# Altium project 12F675_PCB.PrjPcb
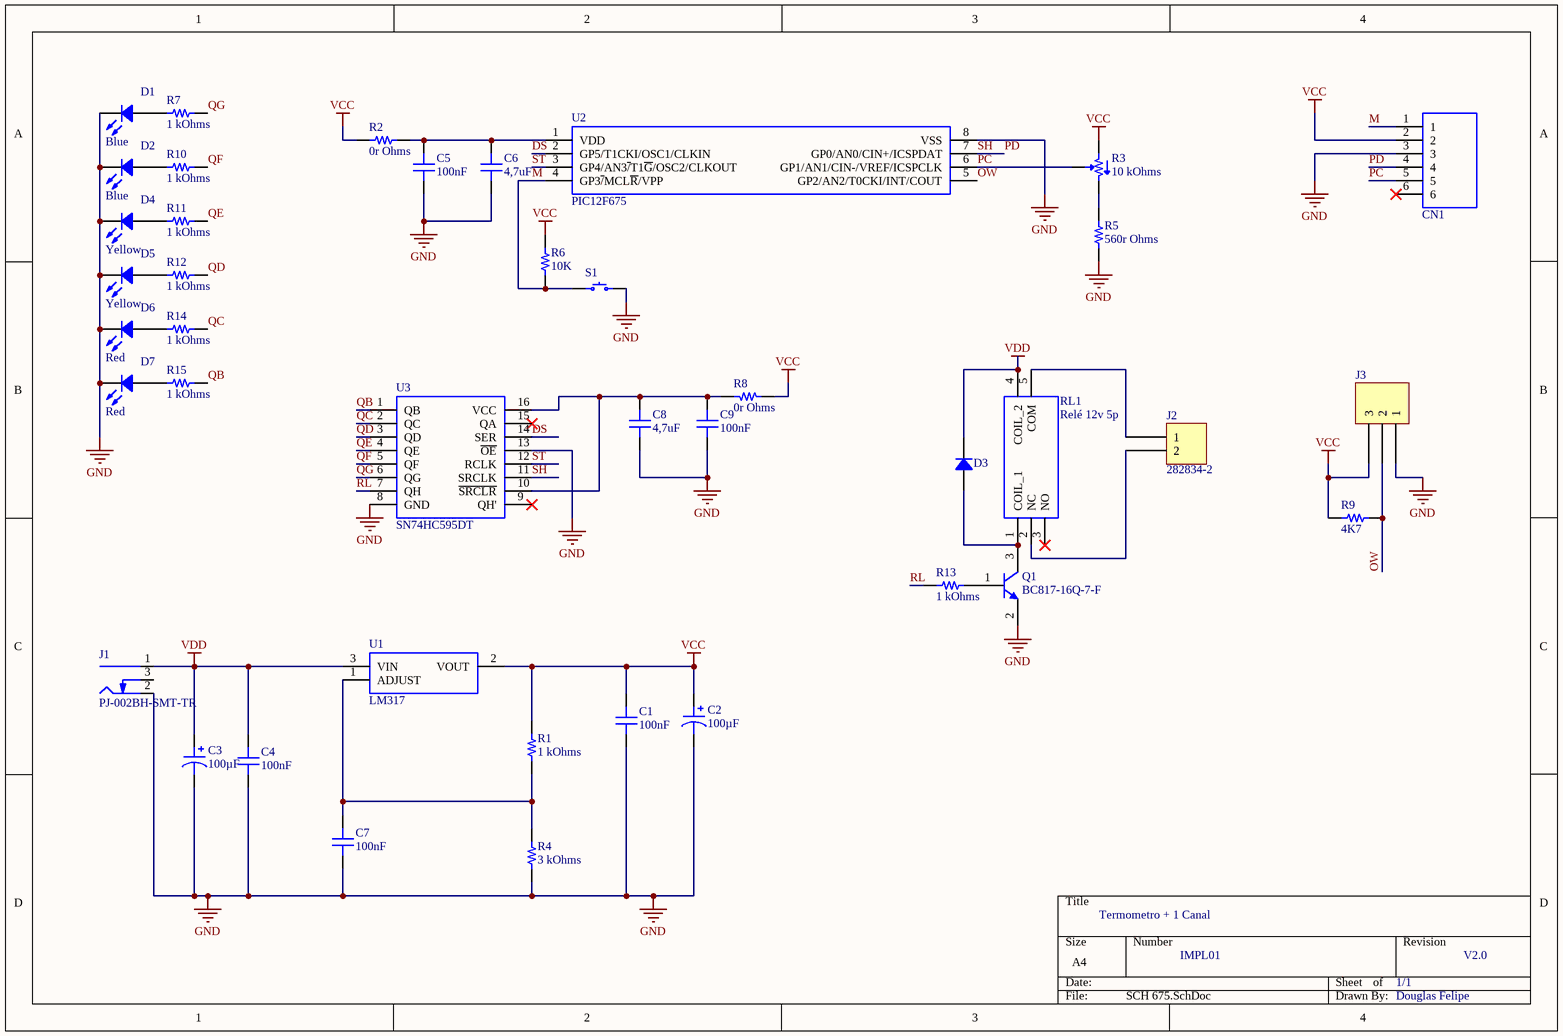
[diagram p0: SCH 675.SchDoc]
1 sheet, 41 parts. Net scope: global (net labels, ports and power ports of the same name join across sheets).
Board file: PCB675.PcbDoc

## Sheet SCH 675.SchDoc
size A4; SheetNumber: 1; SheetTotal: 1

### Parts
C1  100nF  [CAP 0805_2012]
C2  100µF  [CAP ALSMD 8.3MM H10.5MM]
C3  100µF  [CAP ALSMD 8.3MM H10.5MM]
C4  100nF  [CAP 0805_2012]
C5  100nF  [CAP 0805_2012]
C6  4,7uF  [CAP 0805_2012]
C7  100nF  [CAP 0805_2012]
C8  4,7uF  [CAP 0805_2012]
C9  100nF  [CAP 0805_2012]
CN1  KK 6vias  [KK6]  (value not drawn)
D1  Blue  [LED 0805_2012 BLUE]
D2  Blue  [LED 0805_2012 BLUE]
D3  1N4148W-TP  [SOD-123]  (value not drawn)
D4  Yellow  [LED 0805_2012 YELLOW]
D5  Yellow  [LED 0805_2012 YELLOW]
D6  Red  [LED 0805_2012 RED]
D7  Red  [LED 0805_2012 RED]
J1  PJ-002BH-SMT-TR  [CUI PJ-002BH-SMT-TR]
J2  282834-2  [TE 282834-2]
J3  0022272031  [MOLEX KK 0022272031]  (value not drawn)
Q1  BC817-16Q-7-F  [DIODES SOT-23-3]
R1  1 kOhms  [RES 0805_2012]
R2  0r Ohms  [RES 0805_2012]
R3  10 kOhms  [POT BOURNS TRIMPOT TC33]
R4  3 kOhms  [RES 0805_2012]
R5  560r Ohms  [RES 0805_2012]
R6  10K  [RES 0805_2012]
R7  1 kOhms  [RES 0805_2012]
R8  0r Ohms  [RES 0805_2012]
R9  4K7  [RES 0805_2012]
R10  1 kOhms  [RES 0805_2012]
R11  1 kOhms  [RES 0805_2012]
R12  1 kOhms  [RES 0805_2012]
R13  1 kOhms  [RES 0805_2012]
R14  1 kOhms  [RES 0805_2012]
R15  1 kOhms  [RES 0805_2012]
RL1  Relé 12v 5p  [Relé SPDTPW]
S1  KXT341 LHS  [C&K KXT3]  (value not drawn)
U1  LM317  [TO252-3]
U2  PIC12F675  [SOIC8]
U3  SN74HC595DT  [SOIC16]

### Nets
GND: C1.1 C2.2 C3.2 C4.1 C5.1 C6.1 C7.1 C8.1 C9.1 CN1.3 D1.2 D2.2 D4.2 D5.2 D6.2 D7.2 J1.2(Outer) J3.1 Q1.2(E) R4.1 R5.1 S1.2 U2.8(VSS) U3.8(GND) U3.13(~{OE})
VCC: C1.2 C2.1 CN1.2 J3.3 R1.2 R2.2 R3.1 R6.2 R8.2 R9.2 U1.2(VOUT)
VDD: C3.1 C4.2 D3.2 J1.1(Centre) RL1.4(COIL_2) U1.3(VIN)
DS: U2.2(GP5/T1CKI/OSC1/CLKIN) U3.14(SER)
M: CN1.1 R6.1 S1.1 U2.4(GP3~{/}MCL~{R}/VPP)
OW: J3.2 R9.1 U2.5(GP2/AN2/T0CKI/INT/COUT)
PC: CN1.5 R3.2 U2.6(GP1/AN1/CIN-/VREF/ICSPCLK)
PD: CN1.4 U2.7(GP0/AN0/CIN+/ICSPDAT) U3.11(SRCLK)  [also labelled SH]
QB: R15.1 U3.1(QB)
QC: R14.1 U3.2(QC)
QD: R12.1 U3.3(QD)
QE: R11.1 U3.4(QE)
QF: R10.1 U3.5(QF)
QG: R7.1 U3.6(QG)
RL: R13.2 U3.7(QH)
ST: U2.3(GP4/AN3~{/}T1~{G}/OSC2/CLKOUT) U3.12(RCLK)
NetC5_2: C5.2 C6.2 R2.1 U2.1(VDD)
NetC7_2: C7.2 R1.1 R4.2 U1.1(ADJUST)
NetC8_2: C8.2 C9.2 R8.1 U3.10(~{SRCLR}) U3.16(VCC)
NetD1_1: D1.1 R7.2
NetD2_1: D2.1 R10.2
NetD3_1: D3.1 Q1.3(C) RL1.1(COIL_1)
NetD4_1: D4.1 R11.2
NetD5_1: D5.1 R12.2
NetD6_1: D6.1 R14.2
NetD7_1: D7.1 R15.2
NetJ2_1: J2.1 RL1.5(COM)
NetJ2_2: J2.2 RL1.2(NC)
NetQ1_1: Q1.1(B) R13.1
NetR3_3: R3.3 R5.2

Not connected (* = marked no-connect by the designer): CN1 6*; J1 3(SW); RL1 3(NO)*; U3 9(QH')* 15(QA)*

### Notes on the sheet
- Termometro + 1 Canal
- IMPL01
- 1/1
- V2.0
- Douglas Felipe

### Library data of the parts
C1 C4 C5 C7 C9 = 08052A101JAT2A: CAP CER 100PF 200V C0G/NP0 0805; manufacturer: AVX Corporation; Temperature Coefficient: C0G, NP0; Tolerance: ±5%; Part Number: 08052A101JAT2A; Value: 100nF; Applications: General Purpose; Capacitance: 100nF; componentlink1description: Datasheet; componentlink1url: http://datasheets.avx.com/C0GNP0-Dielectric.pdf; componentlink2description: DigiKey Link; componentlink2url: http://digikey.com/product-detail/en/avx-corporation/08052A101JAT2A/478-1272-1-ND/564304; Device Package: 0805 (2012 Metric); lastupdated: 02/09/2020 01:04:41; Lifecycle Status: Active; Minimum Order: 1; Mounting Type: Surface Mount, MLCC; Operating Temperature: -55°C ~ 125°C; Package / Case: 0805 (2012 Metric); packaging: TapeAndReel; partid: 3022; Part Status: Active; price: 0.10; series: -; Size / Dimension: 0.079" L x 0.049" W (2.01mm x 1.25mm); Supplier 1: DigiKey; Supplier Part Number 1: 478-1272-1-ND; Thickness (Max): 0.037" (0.94mm); Voltage - Rated: 200V
C2 C3 = 100SEV22M8X10.5: CAP ALUM 22UF 20% 100V SMD; manufacturer: Rubycon; Lifetime @ Temp.: 2000 Hrs @ 85°C; Polarization: Polar; Ripple Current @ High Frequency: 195 mA @ 10 kHz; Ripple Current @ Low Frequency: 130 mA @ 120 Hz; Surface Mount Land Size: 0.327" L x 0.327" W (8.30mm x 8.30mm); Part Number: 100SEV22M8X10.5; Applications: Automotive; Capacitance: 100µF; componentlink1description: Datasheet; componentlink1url: http://www.rubycon.co.jp/en/catalog/e_pdfs/aluminum/e_sev.pdf; componentlink2description: DigiKey Link; componentlink2url: https://www.digikey.com/en/products/detail/rubycon/100SEV22M8X10-5/3568696; Device Package: Radial, Can - SMD; Height - Seated (Max): 0.413" (10.50mm); lastupdated: 19/09/2022 14:00:28; Lifecycle Status: Active; Minimum Order: 1; Mounting Type: Surface Mount; Operating Temperature: -40°C ~ 85°C; Package / Case: Radial, Can - SMD; packaging: TapeAndReel; partid: 7766; Part Status: Active; price: 0.33; Ratings: AEC-Q200; series: SEV; Size / Dimension: 0.315" Dia (8.00mm); Supplier 1: DigiKey; Supplier Part Number 1: 1189-2383-1-ND; Tolerance: ±20%; value: 100µF; Voltage - Rated: 100 V
C6 C8 = 08052A101JAT2A: CAP CER 100PF 200V C0G/NP0 0805; manufacturer: AVX Corporation; Capacitance: 100nF; Temperature Coefficient: C0G, NP0; Tolerance: ±5%; Part Number: 08052A101JAT2A; Value: 4,7uF; Applications: General Purpose; componentlink1description: Datasheet; componentlink1url: http://datasheets.avx.com/C0GNP0-Dielectric.pdf; componentlink2description: DigiKey Link; componentlink2url: http://digikey.com/product-detail/en/avx-corporation/08052A101JAT2A/478-1272-1-ND/564304; Device Package: 0805 (2012 Metric); lastupdated: 02/09/2020 01:04:41; Lifecycle Status: Active; Minimum Order: 1; Mounting Type: Surface Mount, MLCC; Operating Temperature: -55°C ~ 125°C; Package / Case: 0805 (2012 Metric); packaging: TapeAndReel; partid: 3022; Part Status: Active; price: 0.10; series: -; Size / Dimension: 0.079" L x 0.049" W (2.01mm x 1.25mm); Supplier 1: DigiKey; Supplier Part Number 1: 478-1272-1-ND; Thickness (Max): 0.037" (0.94mm); Voltage - Rated: 200V
D1 D2 = B1701NB--20D000114U1930: 2.0(L)X1.3(W)X0.8(H) MM; Manufacturer: Harvatek Corporation; Current - Test: 20mA; Lens Size: 1.40mm x 1.30mm; Lens Style: Rectangle with Flat Top; Lens Transparency: Diffused; Millicandela Rating: 71.5mcd; Viewing Angle: 130°; Voltage - Forward (Vf) (Typ): 3.3V; Wavelength - Dominant: 470nm; Wavelength - Peak: 468nm; Part Number: B1701NB--20D000114U1930; Color: Blue; ComponentLink1Description: Datasheet; ComponentLink1URL: https://media.digikey.com/pdf/Data%20Sheets/Harvatek%20PDFs/B1701NB--20D000114U1930.pdf; ComponentLink2Description: DigiKey Link; ComponentLink2URL: https://www.digikey.com/en/products/detail/harvatek-corporation/B1701NB-20D000114U1930/16671748; Device Package: 0805 (2012 Metric); Height (Max): 0.90mm; LastUpdated: 19/09/2022 13:49:33; Lifecycle Status: Active; Minimum Order: 1; Mounting Type: Surface Mount; Package / Case: 0805 (2012 Metric); Packaging: TapeAndReel; PartId: 1161; Part Status: Active; Price: 0.09; Series: B1701NB; Size / Dimension: 2.00mm L x 1.30mm W; Supplier 1: DigiKey; Supplier Part Number 1: 3147-B1701NB--20D000114U1930CT-ND; Supplier Device Package: 0805; Value: Blue
D3 = 1N4148W-TP: DIODE GEN PURP 100V 150MA SOD123; Manufacturer: Micro Commercial Co; Capacitance @ Vr, F: 2pF @ 0V, 1MHz; Current - Reverse Leakage @ Vr: 1 µA @ 75 V; Diode Type: Standard; Reverse Recovery Time (trr): 4 ns; Speed: Small Signal =< 200mA (Io), Any Speed; Voltage - Forward (Vf) (Max) @ If: 1.25 V @ 150 mA; Part Number: 1N4148W-TP; ComponentLink1Description: Datasheet; ComponentLink1URL: https://www.mccsemi.com/pdf/Products/1N4148W(SOD123).pdf; ComponentLink2Description: DigiKey Link; ComponentLink2URL: https://www.digikey.com/en/products/detail/micro-commercial-co/1N4148W-TP/717196; Current - Average Rectified (Io): 150mA; LastUpdated: 19/09/2022 13:46:25; Lifecycle Status: Active; Minimum Order: 1; Mounting Type: Surface Mount; Operating Temperature - Junction: -65°C ~ 150°C; Package / Case: SOD-123; Packaging: TapeAndReel; PartId: 999; Part Status: Active; Price: 0.02; Series: -; Supplier 1: DigiKey; Supplier Part Number 1: 1N4148WTPMSCT-ND; Supplier Device Package: SOD-123; Voltage - DC Reverse (Vr) (Max): 100 V
D4 D5 = 5975411407F: LED YELLOW DIFFUSED 2SMD; Manufacturer: Dialight; Configuration: Standard; Current - Test: 20mA; Lens Color: White; Lens Size: 1.19mm x 1.24mm; Lens Style: Rectangle with Flat Top; Millicandela Rating: 11.7mcd; Viewing Angle: 150°; Voltage - Forward (Vf) (Typ): 2.1V; Wavelength - Dominant: 572nm; Wavelength - Peak: 570nm; Part Number: 5975411407F; Color: Yellow; ComponentLink1Description: Datasheet; ComponentLink1URL: http://www.dialightsignalsandcomponents.com/Assets/Brochures_And_Catalogs/Indication/597-3xxx-4xx.pdf; ComponentLink2Description: DigiKey Link; ComponentLink2URL: https://www.digikey.com/en/products/detail/dialight/5975411407F/2432601; Device Package: 0805 (2012 Metric); Height (Max): 0.79mm; LastUpdated: 19/09/2022 13:51:13; Lens Transparency: Diffused; Lifecycle Status: Active; Minimum Order: 1; Mounting Type: Surface Mount; Package / Case: 0805 (2012 Metric); Packaging: TapeAndReel; PartId: 55; Part Status: Active; Price: 0.24; Series: 597; Size / Dimension: 2.00mm L x 1.25mm W; Supplier 1: DigiKey; Supplier Part Number 1: 350-2953-1-ND; Supplier Device Package: 2-SMD; Value: Yellow
D6 D7 = VFHV1112H-3BZ2B-TR: LED; Manufacturer: Stanley Electric Co; Configuration: Standard; Current - Test: 20mA; Lens Color: White; Lens Size: 1.30mm x 1.25mm; Lens Style: Rectangle with Flat Top; Millicandela Rating: 110mcd; Viewing Angle: 140°; Voltage - Forward (Vf) (Typ): 1.9V; Wavelength - Dominant: 615nm; Wavelength - Peak: 624nm; Part Number: VFHV1112H-3BZ2B-TR; Color: Red; ComponentLink1Description: Datasheet; ComponentLink1URL: http://www.stanley-components.com/php/downloaddatafile.php?rp=0,VFHV1112H-3BZ2B-TR_e.pdf; ComponentLink2Description: DigiKey Link; ComponentLink2URL: http://digikey.com/product-detail/en/stanley-electric-co/VFHV1112H-3BZ2B-TR/404-1314-1-ND/9477319; Device Package: 0805 (2012 Metric); Height (Max): 0.90mm; LastUpdated: 19/09/2022 13:50:32; Lifecycle Status: Active; Minimum Order: 1; Mounting Type: Surface Mount; Package / Case: 0805 (2012 Metric); Packaging: TapeAndReel; PartId: 359; Part Status: Active; Price: 0.08; Series: -; Size / Dimension: 2.00mm L x 1.25mm W; Supplier 1: DigiKey; Supplier Part Number 1: 404-1314-1-ND; Value: Red
J1 = PJ-002BH-SMT-TR: CONN PWR JACK 2.5X5.5MM SOLDER; Manufacturer: CUI Devices; Actual Diameter: 0.098" (2.50mm ID), 0.256" (6.50mm OD); Current Rating (Amps): 5A; Gender: Male; Industry Recognized Mating Diameter: 2.50mm ID (0.098"), 5.50mm OD (0.217"); Internal Switch(s): Single Switch, Normally Closed; Material Flammability Rating: UL94 V-0; Mating Length/Depth: 0.350" (8.90mm); Number of Positions/Contacts: 2 Conductors, 3 Contacts; Shielding: Unshielded; Voltage - Rated: 24VDC; Part Number: PJ-002BH-SMT-TR; ComponentLink1Description: Datasheet; ComponentLink1URL: https://www.cuidevices.com/product/resource/digikeypdf/pj-002bh-smt-tr.pdf; ComponentLink2Description: DigiKey Link; ComponentLink2URL: http://digikey.com/product-detail/en/cui-devices/PJ-002BH-SMT-TR/CP-002BHPJCT-ND/669694; Connector Type: Jack; Features: Board Guide, Solder Retention; LastUpdated: 26/05/2020 13:34:08; Lifecycle Status: Active; Minimum Order: 1; Mounting Type: Surface Mount, Right Angle; Packaging: TapeAndReel; Part Status: Active; Price: 0.90; Series: -; Supplier 1: DigiKey; Supplier Part Number 1: CP-002BHPJCT-ND; Termination: Solder
J2 = 282834-2: TERM BLK 2P SIDE ENT 2.54MM PCB; Manufacturer: TE Connectivity AMP Connectors; Current: 10A; Mating Orientation: Horizontal with Board; Number of Levels: 1; Pitch: 0.100" (2.54mm); Positions Per Level: 2; Voltage: 150V; Wire Gauge: 16-30 AWG; Wire Termination: Screw - Rising Cage Clamp; Part Number: 282834-2; Color: Green; ComponentLink1Description: Datasheet; ComponentLink1URL: https://www.te.com/commerce/DocumentDelivery/DDEController?Action=srchrtrv&DocNm=282834&DocType=Customer+Drawing&DocLang=English; ComponentLink2Description: DigiKey Link; ComponentLink2URL: http://digikey.com/product-detail/en/te-connectivity-amp-connectors/282834-2/A98333-ND/1150135; LastUpdated: 15/01/2020 04:15:38; Lifecycle Status: Active; Minimum Order: 1; Mounting Type: Through Hole; Packaging: Bulk; Part Status: Active; Price: 0.88; Series: Buchanan; Supplier 1: DigiKey; Supplier Part Number 1: A98333-ND
J3 = 0022272031: CONN HEADER VERT 3POS 2.54MM; Manufacturer: Molex; Contact Length - Mating: 0.295" (7.49mm); Contact Length - Post: 0.140" (3.56mm); Material Flammability Rating: UL94 V-0; Number of Positions: 3; Number of Positions Loaded: All; Overall Contact Length: 0.560" (14.22mm); Pitch - Mating: 0.100" (2.54mm); Shrouding: Shrouded - 1 Wall; Style: Board to Cable/Wire; Part Number: 0022272031; ComponentLink1Description: Datasheet; ComponentLink1URL: https://www.molex.com/pdm_docs/sd/022272031_sd.pdf; ComponentLink2Description: DigiKey Link; ComponentLink2URL: http://digikey.com/product-detail/en/molex/0022272031/WM4112-ND/1130578; Connector Type: Header; Contact Finish - Mating: Tin; Contact Finish - Post: Tin; Contact Finish Thickness - Mating: 100.0µin (2.54µm); Contact Material: Brass; Contact Shape: Square; Contact Type: Male Pin; Fastening Type: Friction Lock; Insulation Color: Natural; Insulation Height: 0.461" (11.70mm); Insulation Material: Polyamide (PA), Nylon; LastUpdated: 12/01/2020 23:51:54; Lifecycle Status: Active; Minimum Order: 1; Mounting Type: Through Hole; Number of Rows: 1; Packaging: Bulk; PartId: 77; Part Status: Active; Price: 0.37; Series: KK 6410; Supplier 1: DigiKey; Supplier Part Number 1: WM4112-ND; Termination: Solder
Q1 = BC817-16Q-7-F: TRANS NPN 45V 0.5A SOT23-3; Manufacturer: Diodes Incorporated; Current - Collector Cutoff (Max): 100nA; Current - Collector (Ic) (Max): 500 mA; DC Current Gain (hFE) (Min) @ Ic, Vce: 100 @ 100mA, 1V; Frequency - Transition: 100MHz; Power - Max: 310 mW; Vce Saturation (Max) @ Ib, Ic: 700mV @ 50mA, 500mA; Part Number: BC817-16Q-7-F; ComponentLink1Description: Datasheet; ComponentLink1URL: https://www.diodes.com/assets/Datasheets/BC817-16Q_40Q.pdf; ComponentLink2Description: DigiKey Link; ComponentLink2URL: https://www.digikey.com/en/products/detail/diodes-incorporated/BC817-16Q-7-F/6187213; LastUpdated: 19/09/2022 14:06:44; Lifecycle Status: Active; Minimum Order: 1; Mounting Type: Surface Mount; Operating Temperature: -65°C ~ 150°C (TJ); Package / Case: TO-236-3, SC-59, SOT-23-3; Packaging: TapeAndReel; PartId: 88; Part Status: Active; Price: 0.03; Series: Automotive, AEC-Q101; Supplier 1: DigiKey; Supplier Part Number 1: BC817-16Q-7-FDICT-ND; Supplier Device Package: SOT-23-3; Transistor Type: NPN; Voltage - Collector Emitter Breakdown (Max): 45 V
R1 R2 R5 R7 R8 R10-R15 = RNCS0805BKE1K00: RES 1K OHM 0.1% 1/10W 0805; Manufacturer: Stackpole Electronics Inc; Power (Watts): 0.1W, 1/10W; Temperature Coefficient: ±25ppm/°C; Part Number: RNCS0805BKE1K00; ComponentLink1Description: Datasheet; ComponentLink1URL: https://www.seielect.com/catalog/sei-rncs_rnch.pdf; ComponentLink2Description: DigiKey Link; ComponentLink2URL: https://www.digikey.com/en/products/detail/stackpole-electronics-inc/RNCS0805BKE1K00/1800073; Composition: Thin Film; Device Package: 0805 (2012 Metric); Features: Anti-Corrosive, Automotive AEC-Q200, Moisture Resistant; Height - Seated (Max): 0.026" (0.65mm); LastUpdated: 19/09/2022 13:36:59; Lifecycle Status: Active; Minimum Order: 1; Number of Terminations: 2; Operating Temperature: -55°C ~ 155°C; Package / Case: 0805 (2012 Metric); Packaging: TapeAndReel; PartId: 27715; Part Status: Active; Price: 0.09; Ratings: AEC-Q200; Series: RNCS; Size / Dimension: 0.079" L x 0.049" W (2.00mm x 1.25mm); Supplier 1: DigiKey; Supplier Part Number 1: RNCS0805BKE1K00CT-ND; Supplier Device Package: 0805; Tolerance: ±0.1%
  R1 R7 R10-R15: Value: 1 kOhms; Resistance: 1 kOhms
  R2 R8: Value: 0r Ohms; Resistance: 0r Ohms
  R5: Value: 560r Ohms; Resistance: 560r Ohms
R3 = TC33X-1-103E: TRIMMER 10K OHM 0.1W J LEAD TOP; Manufacturer: Bourns Inc.; Adjustment Type: Top Adjustment; Number of Turns: 1; Power (Watts): 0.1W, 1/10W; Resistive Material: Cermet; Temperature Coefficient: ±250ppm/°C; Tolerance: ±25%; Part Number: TC33X-1-103E; ComponentLink1Description: Datasheet; ComponentLink1URL: https://www.bourns.com/docs/Product-Datasheets/TC33.pdf; ComponentLink2Description: DigiKey Link; ComponentLink2URL: https://www.digikey.com/en/products/detail/bourns-inc/TC33X-1-103E/2566867; LastUpdated: 19/09/2022 13:51:26; Lifecycle Status: Active; Minimum Order: 1; Mounting Type: Surface Mount; Packaging: TapeAndReel; PartId: 9; Part Status: Active; Price: 0.11; Resistance: 10 kOhms; Series: Trimpot® TC33 - Open Frame; Size / Dimension: Rectangular - 0.150" x 0.142" Face (3.80mm x 3.60mm); Supplier 1: DigiKey; Supplier Part Number 1: TC33X-1-103ECT-ND; Termination Style: J Lead; Value: 10 kOhms
R4 = RT0805DRD073KL: RES SMD 3K OHM 0.5% 1/8W 0805; Manufacturer: Yageo; Power (Watts): 0.125W, 1/8W; Temperature Coefficient: ±25ppm/°C; Part Number: RT0805DRD073KL; Value: 3 kOhms; ComponentLink1Description: Datasheet; ComponentLink1URL: https://www.yageo.com/upload/media/product/productsearch/datasheet/rchip/PYu-RT_1-to-0.01_RoHS_L_11.pdf; ComponentLink2Description: DigiKey Link; ComponentLink2URL: http://digikey.com/product-detail/en/yageo/RT0805DRD073KL/311-2744-1-ND/6129163; Composition: Thin Film; Device Package: 0805 (2012 Metric); Height - Seated (Max): 0.024" (0.60mm); LastUpdated: 19/09/2022 13:36:59; Lifecycle Status: Active; Minimum Order: 1; Number of Terminations: 2; Operating Temperature: -55°C ~ 155°C; Package / Case: 0805 (2012 Metric); Packaging: TapeAndReel; PartId: 27799; Part Status: Active; Price: 0.03; Resistance: 3 kOhms; Series: RT; Size / Dimension: 0.079" L x 0.049" W (2.00mm x 1.25mm); Supplier 1: DigiKey; Supplier Part Number 1: 311-2744-1-ND; Supplier Device Package: 0805; Tolerance: ±0.5%
R6 = RNCS0805BKE1K00: RES 1K OHM 0.1% 1/10W 0805; Manufacturer: Stackpole Electronics Inc; Power (Watts): 0.1W, 1/10W; Resistance: 10k Ohms; Temperature Coefficient: ±25ppm/°C; Part Number: RNCS0805BKE1K00; Value: 10K; ComponentLink1Description: Datasheet; ComponentLink1URL: https://www.seielect.com/catalog/sei-rncs_rnch.pdf; ComponentLink2Description: DigiKey Link; ComponentLink2URL: https://www.digikey.com/en/products/detail/stackpole-electronics-inc/RNCS0805BKE1K00/1800073; Composition: Thin Film; Device Package: 0805 (2012 Metric); Features: Anti-Corrosive, Automotive AEC-Q200, Moisture Resistant; Height - Seated (Max): 0.026" (0.65mm); LastUpdated: 19/09/2022 13:36:59; Lifecycle Status: Active; Minimum Order: 1; Number of Terminations: 2; Operating Temperature: -55°C ~ 155°C; Package / Case: 0805 (2012 Metric); Packaging: TapeAndReel; PartId: 27715; Part Status: Active; Price: 0.09; Ratings: AEC-Q200; Series: RNCS; Size / Dimension: 0.079" L x 0.049" W (2.00mm x 1.25mm); Supplier 1: DigiKey; Supplier Part Number 1: RNCS0805BKE1K00CT-ND; Supplier Device Package: 0805; Tolerance: ±0.1%
R9 = RNCS0805BKE1K00: RES 1K OHM 0.1% 1/10W 0805; Manufacturer: Stackpole Electronics Inc; Power (Watts): 0.1W, 1/10W; Resistance: 4,7k Ohms; Temperature Coefficient: ±25ppm/°C; Part Number: RNCS0805BKE1K00; Value: 4K7; ComponentLink1Description: Datasheet; ComponentLink1URL: https://www.seielect.com/catalog/sei-rncs_rnch.pdf; ComponentLink2Description: DigiKey Link; ComponentLink2URL: https://www.digikey.com/en/products/detail/stackpole-electronics-inc/RNCS0805BKE1K00/1800073; Composition: Thin Film; Device Package: 0805 (2012 Metric); Features: Anti-Corrosive, Automotive AEC-Q200, Moisture Resistant; Height - Seated (Max): 0.026" (0.65mm); LastUpdated: 19/09/2022 13:36:59; Lifecycle Status: Active; Minimum Order: 1; Number of Terminations: 2; Operating Temperature: -55°C ~ 155°C; Package / Case: 0805 (2012 Metric); Packaging: TapeAndReel; PartId: 27715; Part Status: Active; Price: 0.09; Ratings: AEC-Q200; Series: RNCS; Size / Dimension: 0.079" L x 0.049" W (2.00mm x 1.25mm); Supplier 1: DigiKey; Supplier Part Number 1: RNCS0805BKE1K00CT-ND; Supplier Device Package: 0805; Tolerance: ±0.1%
S1 = KXT341 LHS: SWITCH TACTILE SPST-NO 0.02A 15V; Manufacturer: C&K; Actuator Height off PCB, Vertical: 0.60mm; Actuator Orientation: Top Actuated; Actuator Type: Standard; Contact Rating @ Voltage: 0.02A @ 15VDC; Illumination: Non-Illuminated; Operating Force: 330gf; Outline: 3.00mm x 2.00mm; Switch Function: Off-Mom; Part Number: KXT341 LHS; Circuit: SPST-NO; ComponentLink1Description: Datasheet; ComponentLink1URL: https://dznh3ojzb2azq.cloudfront.net/products/Tactile/KXT3/documents/datasheet.pdf; ComponentLink2Description: DigiKey Link; ComponentLink2URL: https://www.digikey.com/en/products/detail/c-k/KXT341-LHS/6607322; LastUpdated: 19/09/2022 14:02:57; Lifecycle Status: Active; Minimum Order: 1; Mounting Type: Surface Mount; Operating Temperature: -40°C ~ 85°C; Packaging: TapeAndReel; Part Status: Active; Price: 0.13; Series: KXT3; Supplier 1: DigiKey; Supplier Part Number 1: CKN10781CT-ND; Termination Style: SMD (SMT) Tab